# Altium schematic sheet 00 PCB SPEC.SchDoc
size A2
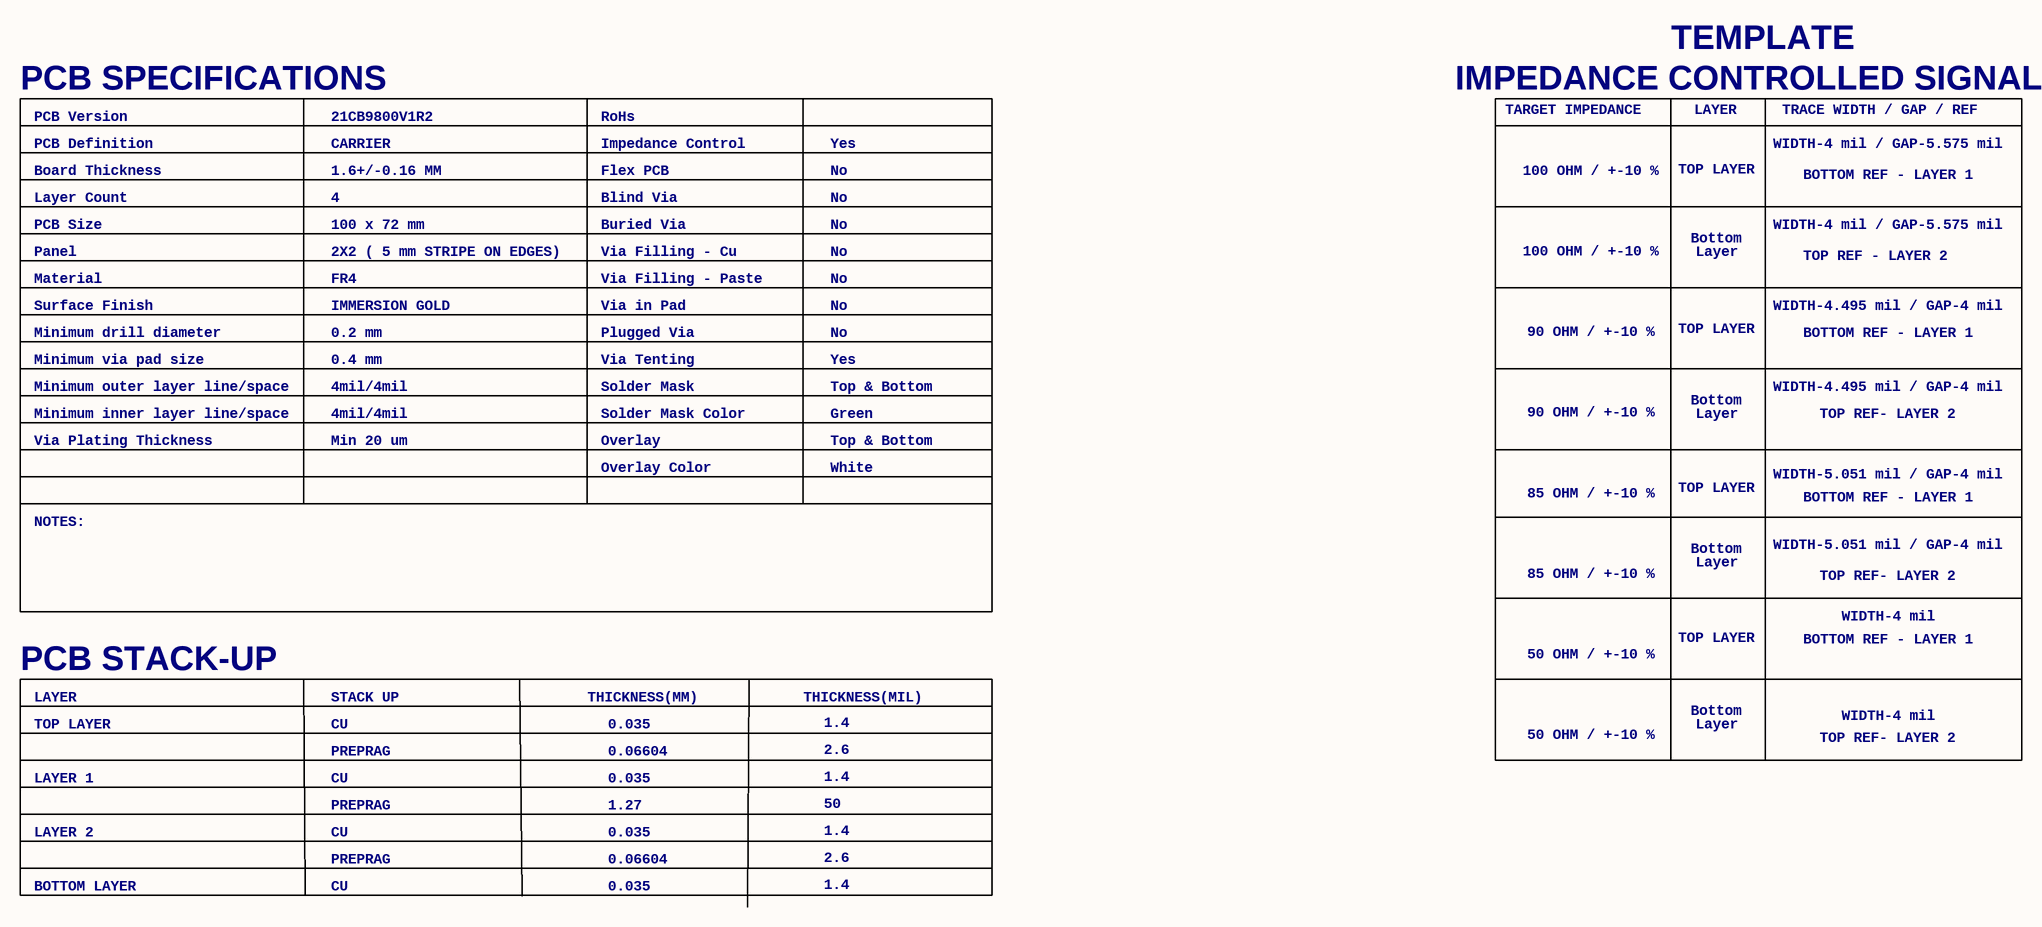
[diagram p0: 00 PCB SPEC.SchDoc]

## Notes on the sheet
- TEMPLATE
- PCB SPECIFICATIONS
- PCB Version
- 21CB9800V1R2
- RoHs
- IMPEDANCE CONTROLLED SIGNALS
- TARGET IMPEDANCE
- LAYER
- TRACE WIDTH / GAP / REF
- Board Thickness
- Layer Count
- PCB Definition
- 1.6+/-0.16 MM
- 4
- CARRIER
- Impedance Control
- Flex PCB
- Blind Via
- Yes
- No
- 100 OHM / +-10 %
- TOP LAYER
- WIDTH-4 mil / GAP-5.575 mil
- BOTTOM REF - LAYER 1
- PCB Size
- Panel
- 100 x 72 mm
- 2X2 ( 5 mm STRIPE ON EDGES)
- Buried Via
- Via Filling - Cu
- Bottom
- Layer
- TOP REF - LAYER 2
- Material
- Minimum drill diameter
- Surface Finish
- FR4
- IMMERSION GOLD
- 0.2 mm
- Via Filling - Paste
- Via in Pad
- Plugged Via
- 90 OHM / +-10 %
- WIDTH-4.495 mil / GAP-4 mil
- Minimum via pad size
- Minimum outer layer line/space
- 0.4 mm
- 4mil/4mil
- Via Tenting
- Solder Mask
- Top & Bottom
- Minimum inner layer line/space
- Via Plating Thickness
- Min 20 um
- Solder Mask Color
- Overlay
- Overlay Color
- Green
- White
- WIDTH-5.051 mil / GAP-4 mil
- TOP REF- LAYER 2
- NOTES:
- 85 OHM / +-10 %
- PCB STACK-UP
- 50 OHM / +-10 %
- WIDTH-4 mil
- STACK UP
- CU
- THICKNESS(MM)
- 0.035
- THICKNESS(MIL)
- 1.4
- LAYER 1
- PREPRAG
- 0.06604
- 1.27
- 2.6
- 50
- LAYER 2
- BOTTOM LAYER
- Sheet Title:
- Project:
- Inventron
- Electronics and Software
- Size:
- Date:
- Drawn By:
- Revision:
- Checked By:
- A4
- Sheet
- Time:
- of
- Budotek Teknopark
- Dudullu OSB
- Des 2. Cadde No:8/30
- ©2020 Inventron Electronics and Software. All rights reserved.
- Umraniye / ISTANBUL